# Altium project Interface.PrjPCB
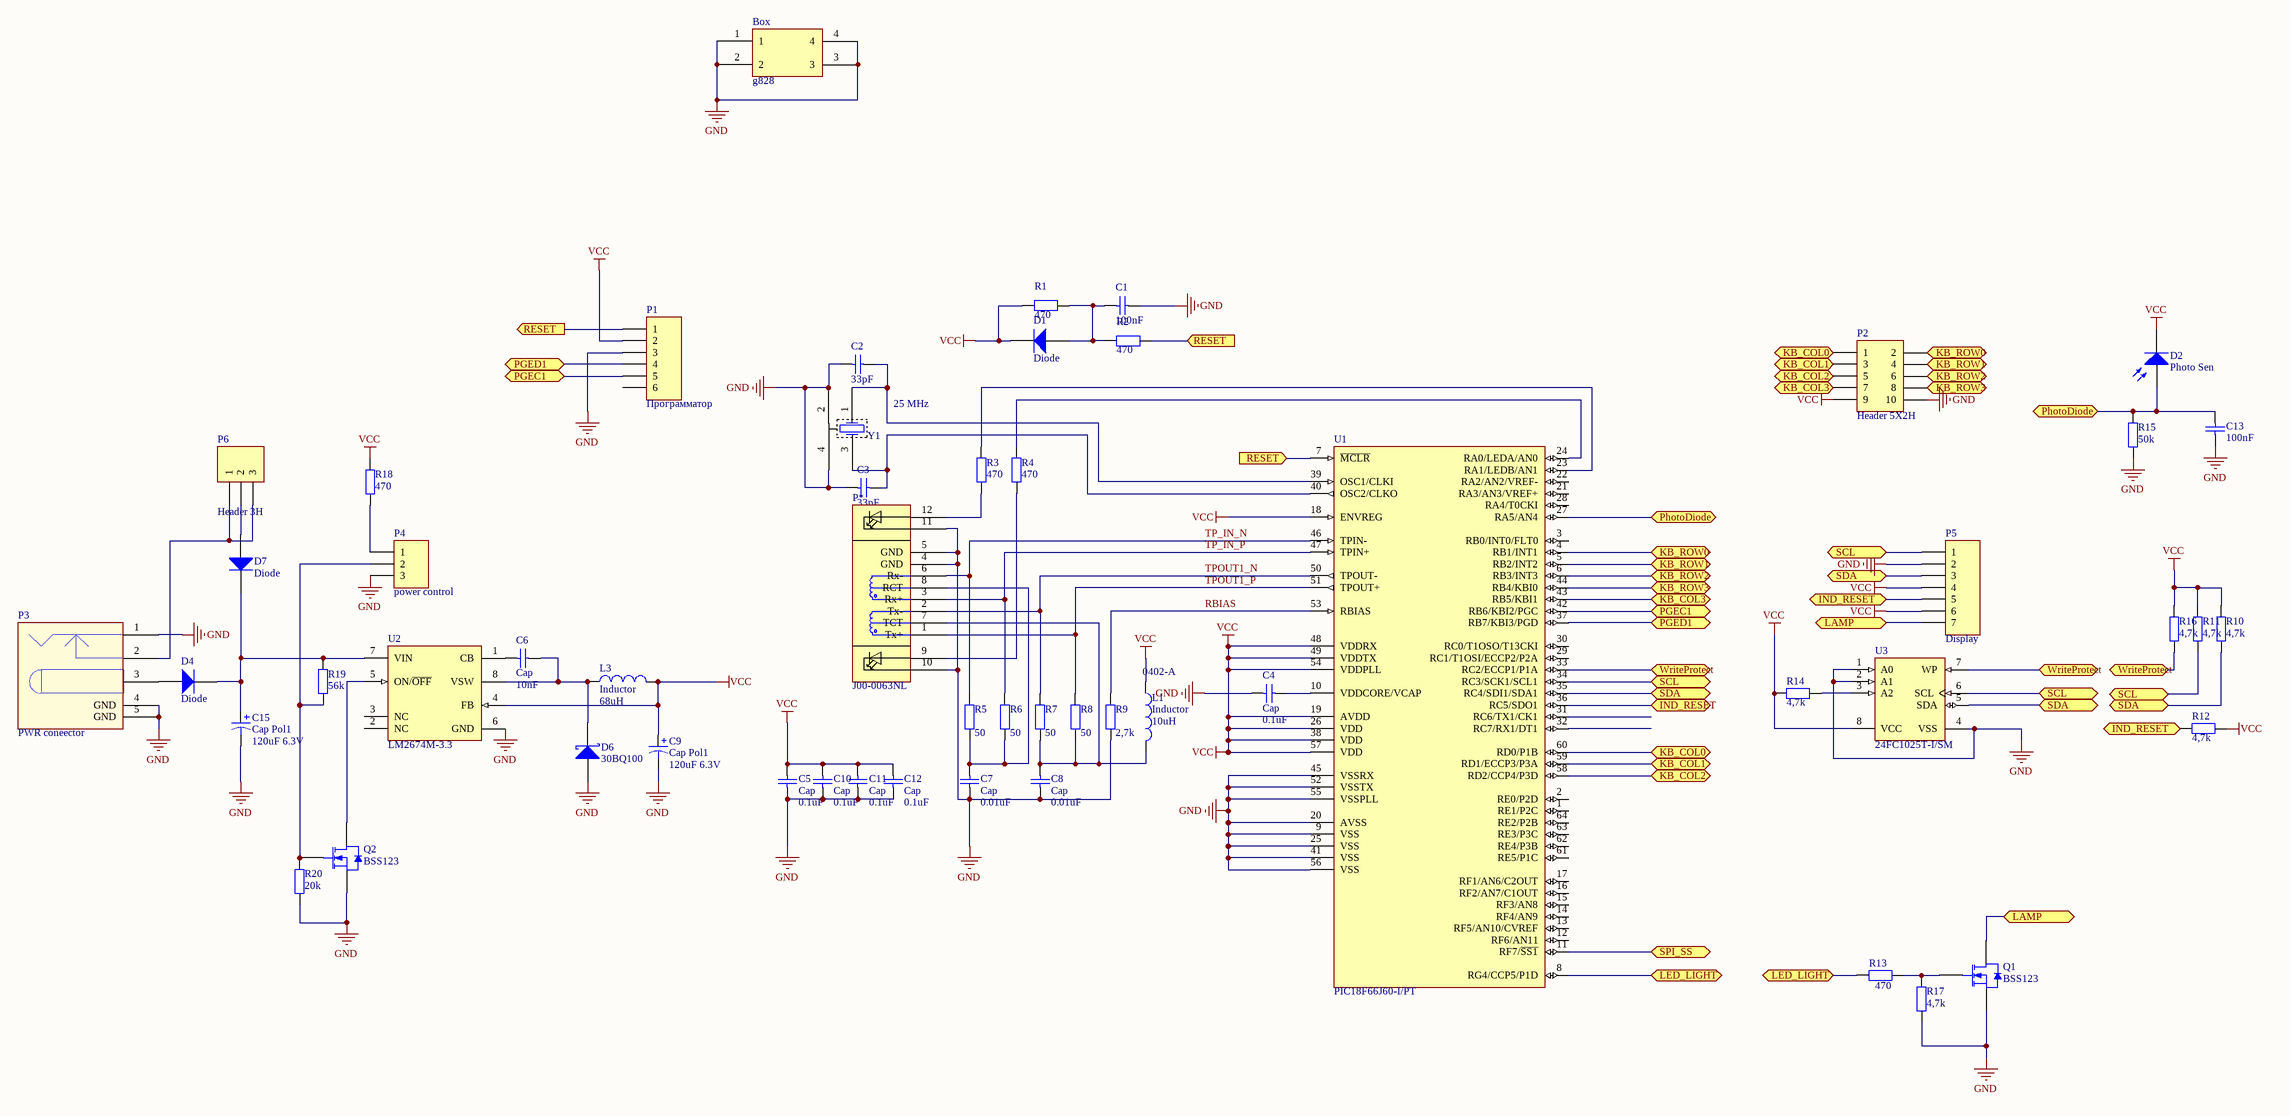
[diagram p0: Interface.SchDoc]
1 sheet, 55 parts. Net scope: flat (ports and power ports of the same name join across sheets).
Board file: Interface.PcbDoc

## Sheet Interface.SchDoc
size A2

### Parts
Box  g828  [G828]  (no BOM)
C1  value 100nF  [CAPC3225L]  (hidden comment: Cap)
C2  value 33pF  [CAPC2012L]  (hidden comment: Cap)
C3  value 33pF  [CAPC2012L]  (hidden comment: Cap)
C4  Cap  value 0.1uF  [CAPC3225L]
C5  Cap  value 0.1uF  [CAPC3225L]
C6  Cap  value 10nF  [CAPC2512L]
C7  Cap  value 0.01uF  [CAPC2512L]
C8  Cap  value 0.01uF  [CAPC2512L]
C9  Cap Pol1  value 120uF 6.3V  [Type D]
C10  Cap  value 0.1uF  [CAPC3225L]
C11  Cap  value 0.1uF  [CAPC3225L]
C12  Cap  value 0.1uF  [CAPC3225L]
C13  value 100nF  [CAPC3225L]  (hidden comment: Cap)
C15  Cap Pol1  value 120uF 6.3V  [Type E]
D1  Diode  [DSO-C2/D5.6]
D2  Photo Sen  [PIN2]
D4  Diode  [SMC wbody]
D6  30BQ100  [SMC wbody]
D7  Diode  [SMC wbody]
L1  Inductor  value 10uH  PackageReference: 0402-A  [INDC4532L]
L3  Inductor  value 68uH  [CDRH5D28NP]
P1  Программатор  [HDR1X6]
P2  Header 5X2H  [HDR2X5H]
P3  PWR coneector  [PWR Con]
P4  power control  [HDR1X3]
P5  Display  [HDR1X7]
P6  Header 3H  [HDR1X3H]
P*  J00-0063NL  [EthernetCON]
Q1  BSS123  [SOT23_N]
Q2  BSS123  [SOT23_N]
R1  value 470  [RESC2012M]  (hidden comment: Res2)
R2  value 470  [RESC2012M]  (hidden comment: Res2)
R3  value 470  [RESC2012M]  (hidden comment: Res2)
R4  value 470  [RESC2012M]  (hidden comment: Res2)
R5  value 50  [RESC2012M]  (hidden comment: Res2)
R6  value 50  [RESC2012M]  (hidden comment: Res2)
R7  value 50  [RESC2012M]  (hidden comment: Res2)
R8  value 50  [RESC2012M]  (hidden comment: Res2)
R9  value 2,7k  [RESC2012M]  (hidden comment: Res2)
R10  value 4,7k  [RESC2012M]  (hidden comment: Res2)
R11  value 4,7k  [RESC2012M]  (hidden comment: Res2)
R12  value 4,7k  [RESC2012M]  (hidden comment: Res2)
R13  value 470  [RESC2012M]  (hidden comment: Res2)
R14  value 4,7k  [RESC2012M]  (hidden comment: Res2)
R15  value 50k  [RESC2012M]  (hidden comment: Res2)
R16  value 4,7k  [RESC2012M]  (hidden comment: Res2)
R17  value 4,7k  [RESC2012M]  (hidden comment: Res2)
R18  value 470  [RESC2012M]  (hidden comment: Res2)
R19  value 56k  [RESC2012M]  (hidden comment: Res2)
R20  value 20k  [RESC2012M]  (hidden comment: Res2)
U1  PIC18F66J60-I/PT  [TQFP-PT64_N]
U2  LM2674M-3.3  [M08A_N]
U3  24FC1025T-I/SM  [SOIJ-SM8_N]
Y1  value 25 MHz  [HC 49SM]  (hidden comment: Кварцевый резонатор)

### Ports
IND_RESET (bidir), KB_COL0, KB_COL1, KB_COL2, KB_COL3, KB_ROW0, KB_ROW1, KB_ROW2, KB_ROW3, LAMP, LED_LIGHT, PGEC1, PGED1, PhotoDiode, RESET (in), RESET (out), SCL (bidir), SDA (bidir), SPI_SS (bidir), WriteProtect (bidir)

### Nets
GND: Box.1 Box.2 Box.3 Box.4 C1.1 C2.2 C3.1 C4.2 C5.2 C7.1 C8.1 C9.2 C10.2 C11.2 C12.2 C13.2 C15.2 D6.1(A) P1.3 P2.10 P3.1 P3.4(GND) P3.5(GND) P4.3 P5.2 P*.4(GND) P*.5(GND) P*.10 P*.11 P*.13(GND) P*.14(GND) Q1.2(S) Q2.2(S) R9.1 R15.1 R17.2 R20.2 U1.9(VSS) U1.20(AVSS) U1.25(VSS) U1.41(VSS) U1.45(VSSRX) U1.52(VSSTX) U1.55(VSSPLL) U1.56(VSS) U2.6(GND) U3.1(A0) U3.2(A1) U3.4(VSS) Y1.2 Y1.4
VCC: C5.1 C9.1 C10.1 C11.1 C12.1 D1.2(K) D2.2(K) L1.1 L3.2 P1.2 P2.9 P5.4 P5.6 R1.2 R10.1 R11.1 R12.2 R14.1 R16.1 R18.1 U1.18(ENVREG) U1.19(AVDD) U1.26(VDD) U1.38(VDD) U1.48(VDDRX) U1.49(VDDTX) U1.54(VDDPLL) U1.57(VDD) U2.4(FB) U3.8(VCC)
RBIAS: R9.2 U1.53(RBIAS)
TP_IN_N: P*.6(Rx-) R5.2 U1.46(TPIN-)
TP_IN_P: P*.3(Rx+) R6.2 U1.47(TPIN+)
TPOUT1_N: P*.2(Tx-) R7.2 U1.50(TPOUT-)
TPOUT1_P: P*.1(Tx+) R8.2 U1.51(TPOUT+)
NetC1_2: C1.2 D1.1(A) R1.1 R2.2
NetC2_1: C2.1 U1.39(OSC1/CLKI) Y1.1
NetC3_2: C3.2 U1.40(OSC2/CLKO) Y1.3
NetC4_1: C4.1 U1.10(VDDCORE/VCAP)
NetC6_1: C6.1 D6.2(K) L3.1 U2.8(VSW)
NetC6_2: C6.2 U2.1(CB)
NetC7_2: C7.2 P*.8(RCT) R5.1 R6.1
NetC8_2: C8.2 L1.2 P*.7(TCT) R7.1 R8.1
NetC13_1: C13.1 D2.1(A) R15.2 U1.27(RA5/AN4) ; port PhotoDiode
NetC15_1: C15.1 D4.2(K) D7.2(K) R19.1 U2.7(VIN)
NetD4_1: D4.1(A) P3.3
NetD7_1: D7.1(A) P6.2
NetP1_1: P1.1 R2.1 U1.7(~{MCLR}) ; port RESET
NetP1_4: P1.4 U1.37(RB7/KBI3/PGD) ; port PGED1
NetP1_5: P1.5 U1.42(RB6/KBI2/PGC) ; port PGEC1
NetP2_1: P2.1 U1.60(RD0/P1B) ; port KB_COL0
NetP2_2: P2.2 U1.4(RB1/INT1) ; port KB_ROW0
NetP2_3: P2.3 U1.59(RD1/ECCP3/P3A) ; port KB_COL1
NetP2_4: P2.4 U1.5(RB2/INT2) ; port KB_ROW1
NetP2_5: P2.5 U1.58(RD2/CCP4/P3D) ; port KB_COL2
NetP2_6: P2.6 U1.6(RB3/INT3) ; port KB_ROW2
NetP2_7: P2.7 U1.43(RB5/KBI1) ; port KB_COL3
NetP2_8: P2.8 U1.44(RB4/KBI0) ; port KB_ROW3
NetP3_2: P3.2 P6.1 P6.3
NetP4_1: P4.1 R18.2
NetP4_2: P4.2 Q2.1(G) R19.2 R20.1
NetP5_1: P5.1 R11.2 U1.34(RC3/SCK1/SCL1) U3.6(SCL) ; port SCL
NetP5_3: P5.3 R10.2 U1.35(RC4/SDI1/SDA1) U3.5(SDA) ; port SDA
NetP5_5: P5.5 R12.1 U1.36(RC5/SDO1) ; port IND_RESET
NetP5_7: P5.7 Q1.3(D) ; port LAMP
NetP*_9: P*.9 R4.2
NetP*_12: P*.12 R3.2
NetQ1_1: Q1.1(G) R13.2 R17.1
NetQ2_3: Q2.3(D) U2.5(ON/~{OFF})
NetR3_1: R3.1 U1.23(RA1/LEDB/AN1)
NetR4_1: R4.1 U1.24(RA0/LEDA/AN0)
NetR13_1: R13.1 U1.8(RG4/CCP5/P1D) ; port LED_LIGHT
NetR14_2: R14.2 U3.3(A2)
NetR16_2: R16.2 U1.33(RC2/ECCP1/P1A) U3.7(WP) ; port WriteProtect
NetU1_11: U1.11(RF7/~{SS1}) ; port SPI_SS

Not connected (* = marked no-connect by the designer): P1 6; U1 1(RE1/P2C) 2(RE0/P2D) 3(RB0/INT0/FLT0) 12(RF6/AN11) 13(RF5/AN10/CVREF) 14(RF4/AN9) 15(RF3/AN8) 16(RF2/AN7/C1OUT) 17(RF1/AN6/C2OUT) 21(RA3/AN3/VREF+) 22(RA2/AN2/VREF-) 28(RA4/T0CKI) 29(RC1/T1OSI/ECCP2/P2A) 30(RC0/T1OSO/T13CKI) 31(RC6/TX1/CK1) 32(RC7/RX1/DT1) 61(RE5/P1C) 62(RE4/P3B) 63(RE3/P3C) 64(RE2/P2B); U2 2(NC) 3(NC)

### Library data of the parts
C1-C8 C10-C13 = Cap: Capacitor; Published: 8-Jun-2000; LatestRevisionDate: 17-Jul-2002; LatestRevisionNote: Re-released for DXP Platform.; PackageReference: RAD-0.3; Publisher: Altium Limited
C9 C15 = Cap Pol1: Polarized Capacitor (Radial); Published: 8-Jun-2000; LatestRevisionDate: 17-Jul-2002; LatestRevisionNote: Re-released for DXP Platform.; PackageReference: RB7.6-15; Publisher: Altium Limited
D1 D4 D7 = Diode: Default Diode; Published: 8-Jun-2000; LatestRevisionDate: 17-Jul-2002; LatestRevisionNote: Re-released for DXP Platform.; PackageVersion: Sep-1996; PackageReference: SMC; Publisher: Altium Limited; Code_JEDEC: DO-214-AB
D2 = Photo Sen: Photosensitive Diode; Published: 24-Mar-1999; LatestRevisionDate: 17-Jul-2002; LatestRevisionNote: Re-released for DXP Platform.; PackageReference: PIN2; Publisher: Altium Limited
D6 = 30BQ100: Schottky Rectifier; Published: 8-Jun-2000; LatestRevisionDate: 17-Jul-2002; LatestRevisionNote: Re-released for DXP Platform.; DatasheetDocument: PD-2.441A; PackageReference: SMC; Publisher: Altium Limited; Code_JEDEC: DO-214-AB; ComponentLink1Description: Manufacturer Link; ComponentLink1URL: http://www.irf.com/; ComponentLink2Description: Datasheet; ComponentLink2URL: http://www.irf.com/product-info/datasheets/data/30bq100.pdf
L1 L3 = Inductor: Code_IEC: 1005; Published: 8-Jun-2000; LatestRevisionDate: 29-May-2009; LatestRevisionNote: IPC-7351 Footprint Added.; Publisher: Altium Limited; PackageDescription: Chip Inductor; Code_JEITA: 0402
  L3: PackageReference: 0402-A
P1 = Header 6: Header, 6-Pin; LatestRevisionDate: 17-Jul-2002; LatestRevisionNote: Re-released for DXP Platform.; Publisher: Altium Limited
P2 = Header 5X2H: Header, 5-Pin, Dual row, Right Angle; LatestRevisionDate: 17-Jul-2002; LatestRevisionNote: Re-released for DXP Platform.; Publisher: Altium Limited
P4 = Header 3: ON/off(1/0); LatestRevisionDate: 17-Jul-2002; LatestRevisionNote: Re-released for DXP Platform.; Publisher: Altium Limited
P5 = Header 7: Header, 7-Pin; LatestRevisionDate: 17-Jul-2002; LatestRevisionNote: Re-released for DXP Platform.; Publisher: Altium Limited
P6 = Header 3H: Header, 3-Pin, Right Angle; LatestRevisionDate: 17-Jul-2002; LatestRevisionNote: Re-released for DXP Platform.; Publisher: Altium Limited
Q1 Q2 = BSS123: N-channel Enhancement Mode Vertical D-MOSFET; Published: 17-Sep-2003; LatestRevisionDate: 12-Dec-2006; LatestRevisionNote: IPC-7351 Footprint Added.; DatasheetVersion: Apr-1995; PackageVersion: May-1999; PackageReference: SOT23; Publisher: Altium Limited; PackageDescription: 3-Pin SOT-23 Package 0.95 mm Pitch, 2.3 mm Lead Span; ComponentLink1Description: Manufacturer Link; ComponentLink1URL: http://www.semiconductors.philips.com/; ComponentLink2Description: Datasheet; ComponentLink2URL: http://www.semiconductors.philips.com/acrobat/datasheets/BSS123_3.pdf
R1-R20 = Res2: Resistor; Published: 8-Jun-2000; LatestRevisionDate: 17-Jul-2002; LatestRevisionNote: Re-released for DXP Platform.; PackageReference: AXIAL-0.4; Publisher: Altium Limited
U1 = PIC18F66J60-I/PT: High Performance, 1-Mbit Flash Microcontroller with Ethernet, 64K Flash, 64-Pin TQFP, Industrial Temperature Range; Published: 29-Jan-2009; DatasheetVersion: revD, Feb-2008; PackageVersion: revAW, Oct-2008; PackageReference: TQFP-PT64; Publisher: Altium Limited; PackageDescription: 64-Lead Thin Plastic Quad Flat Pack (PT) - 10x10x1mm Body, 2.00mm [TQFP]; Code_JEDEC: MS-026; ComponentLink1Description: Manufacturer Link; ComponentLink1URL: http://www.microchip.com; ComponentLink2Description: Datasheet; ComponentLink2URL: http://ww1.microchip.com/downloads/en/DeviceDoc/39762d.pdf; ComponentLink3Description: Packaging Specification; ComponentLink3URL: http://ww1.microchip.com/downloads/en/PackagingSpec/00049AW.pdf
U2 = LM2674M-3.3: SIMPLE SWITCHER; Power Converter High Efficiency 500mA Step-Down Voltage Regulator; Manufacturer: National Semiconductor; PackageTopMarking: NSZXTT*2674*M3.3; PowerWise: N; Published: 4-Dec-2008; DatasheetVersion: Feb-2005; PackageVersion: revL, Sep-2006; PackageReference: M08A; Publisher: Altium Limited; PackageDescription: SOIC Narrow, 4.9 x 3.9 x 1.45mm, 8 Lead, 1.27mm Pitch; CompType: Switcher; PartNumber: LM2674M-3.3; RoHS: O; PinCount: 8; DigiKeyPartNumber: LM2674M-3.3-ND; Code_JEDEC: MS-012-AA; Code_IPC: SOIC127P600-8; ComponentLink1Description: LM2674 Datasheet; ComponentLink1URL: http://www.national.com/ds/LM/LM2674.pdf; ComponentLink2Description: LM2674 Web Page; ComponentLink2URL: http://www.national.com/pf/LM/LM2674.html; ComponentLink3Description: M08A Package Page; ComponentLink3URL: http://www.national.com/packaging/folders/m08a.html
U3 = 24FC1025T-I/SM: 1 Mbit, 1MHz, 2.5V, I2C Serial EEPROM, 8-Pin SOIC 208mil, Industrial Temperature, Tape and Reel; Published: 29-Jan-2009; DatasheetVersion: revE, Mar-2007; PackageVersion: revAW, Oct-2008; PackageReference: SOIJ-SM8; Publisher: Altium Limited; PackageDescription: 8-Lead Plastic Small Outline (SM) - Medium, 5.28 mm Body [SOIJ]; ComponentLink1Description: Manufacturer Link; ComponentLink1URL: http://www.microchip.com; ComponentLink2Description: Datasheet; ComponentLink2URL: http://ww1.microchip.com/downloads/en/DeviceDoc/21941E.pdf; ComponentLink3Description: Packaging Specification; ComponentLink3URL: http://ww1.microchip.com/downloads/en/PackagingSpec/00049AW.pdf
Y1 = XTAL